# Altium schematic sheet 5V Regulator_1.SchDoc
size A
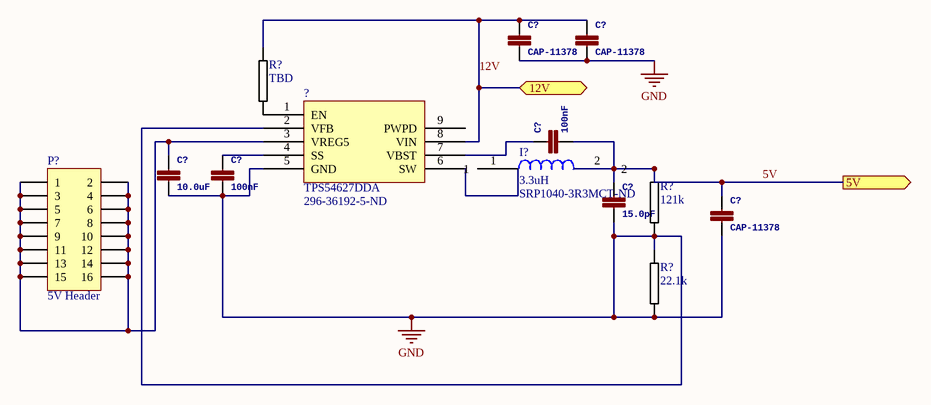
[diagram p0: 5V Regulator_1.SchDoc]

## Parts
(Parts that share a designator on the sheet are numbered #1, #2 ... from top to bottom, then left to right.)
?  TPS54627DDA  Supplier Part Number 1: 296-36192-5-ND  [SOIC127P600X170_HS-9N]
C?#1  CAP-11378  [0603]
C?#2  CAP-11378  [0603]
C?#3  100nF  [0603]
C?#4  10.0uF  [0603]
C?#5  100nF  [0603]
C?#6  15.0pF  [0603]
C?#7  CAP-11378  [0603]
I?  3.3uH  Supplier Part Number 1: SRP1040-3R3MCT-ND  [SRP1040]
P?  5V Header  [HDR2X8H]
R?#1  TBD  [0402R-TBD]
R?#2  121k  [0402R-TBD]
R?#3  22.1k  [0402R-TBD]

## Ports
5V (out), 12V

## Nets
GND: ?.2(VFB) ?.5(GND) C?#1.2 C?#2.2 C?#4.2 C?#5.2 C?#6.2 C?#7.2 R?#2.2 R?#3.1 R?#3.2
5V: C?#3.2 C?#6.1 C?#7.1 I?.2 R?#2.1 ; port 5V
12V: ?.8(VIN) C?#1.1 C?#2.1 R?#1.1 ; port 12V
Net?_1: ?.1(EN) R?#1.2
Net?_3: ?.3(VREG5) C?#4.1 P?.1 P?.2 P?.3 P?.4 P?.5 P?.6 P?.7 P?.8 P?.9 P?.10 P?.11 P?.12 P?.13 P?.14 P?.15 P?.16
Net?_4: ?.4(SS) C?#5.1
Net?_6: ?.6(SW) I?.1
Net?_7: ?.7(VBST) C?#3.1

Not connected (* = marked no-connect by the designer): ? 9(PWPD)

## Library data of the parts
? = TPS54627DDA: IC REG BUCK ADJ 6A SYNC 8SOPWR; Manufacturer: Texas Instruments; Function: Step-Down; Output Configuration: Positive; Output Type: Adjustable; Number of Outputs: 1; Voltage - Input (Min): 4.5V; Voltage - Input (Max): 18V; Voltage - Output (Min/Fixed): 0.765V; Voltage - Output (Max): 5.5V; Frequency - Switching: 650kHz; Synchronous Rectifier: Yes; Supplier 1: Digi-Key; Manufacturer Part Number: TPS54627DDA; RoHS: RoHS Compliant; Category: Integrated Circuits (ICs); Stock 1: 282; Pricing 1: 1=2.94, 10=2.639, 100=2.1626, 500=1.84094, 1000=1.5526 (USD); Packaging: Tube; Part Status: Active; Topology: Buck; Current - Output: 6A; Operating Temperature: -40°C ~ 85°C (TA); Mounting Type: Surface Mount; Package / Case: 8-PowerSOIC (0.154", 3.90mm Width); Supplier Device Package: 8-SO PowerPad; Base Part Number: TPS54627; ComponentLink1URL: http://www.ti.com/lit/ds/symlink/tps54627.pdf; ComponentLink1Description: http://www.ti.com/lit/ds/symlink/tps54627.pdf
C?#1 C?#2 C?#7 = 4.7NF-50V-10%(0603): PROD_ID: CAP-11378
C?#3-C?#6 = 4.7NF-50V-10%(0603): PROD_ID: CAP-11378
I? = SRP1040-3R3M: FIXED IND 3.3UH 10A 10 MOHM SMD; Manufacturer: Bourns Inc.; Material - Core: Iron; Tolerance: ±20%; Shielding: Shielded; DC Resistance (DCR): 10 mOhm Max; Supplier 1: Digi-Key; Manufacturer Part Number: SRP1040-3R3M; RoHS: RoHS Compliant; Category: Inductors, Coils, Chokes; Stock 1: 575; Pricing 1: 1=1.43, 10=1.32, 100=0.9237 (USD); Packaging: Cut Tape (CT); Part Status: Active; Type: -; Q @ Freq: -; Ratings: -; Operating Temperature: -55°C ~ 150°C; Mounting Type: Surface Mount; Package / Case: Nonstandard; Supplier Device Package: -; Size / Dimension: 0.465" L x 0.413" W (11.80mm x 10.50mm); Height - Seated (Max): 0.165" (4.20mm); ComponentLink1URL: http://www.bourns.com/docs/Product-Datasheets/SRP1040.pdf; ComponentLink1Description: http://www.bourns.com/docs/Product-Datasheets/SRP1040.pdf
P? = Header 8X2H: Header, 8-Pin, Dual row, Right Angle; LatestRevisionDate: 17-Jul-2002; LatestRevisionNote: Re-released for DXP Platform.; Publisher: Altium Limited
R?#1-R?#3 = 0402R-TBD: RESISTOR 0402 VALUE TO BE DETERMINED